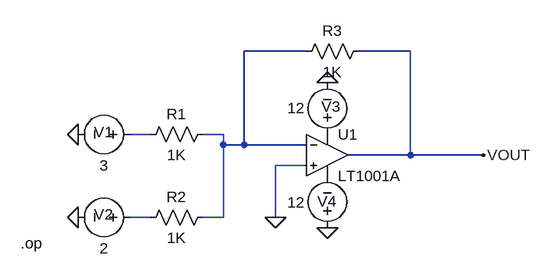
[diagram p0: schematic Summing Amplifier.asc]
Summing Amplifier.asc, the LTspice schematic file:
Version 4
SHEET 1 880 680
WIRE 208 -16 112 -16
WIRE 368 -16 288 -16
WIRE -32 112 -64 112
WIRE 80 112 48 112
WIRE 80 128 80 112
WIRE 112 128 112 -16
WIRE 112 128 80 128
WIRE 208 128 112 128
WIRE 368 144 368 -16
WIRE 368 144 272 144
WIRE 480 144 368 144
WIRE 208 160 160 160
WIRE -32 240 -64 240
WIRE 80 240 80 128
WIRE 80 240 48 240
WIRE 160 240 160 160
FLAG -144 112 0
FLAG -144 240 0
FLAG 160 240 0
FLAG 240 32 0
FLAG 240 256 0
FLAG 480 144 VOUT
SYMBOL OpAmps\\LT1001A 240 80 R0
SYMATTR InstName U1
SYMBOL voltage -48 112 R90
WINDOW 0 12 56 VBottom 2
WINDOW 3 32 56 VTop 2
WINDOW 123 0 0 Left 0
WINDOW 39 0 0 Left 0
SYMATTR InstName V1
SYMATTR Value 3
SYMBOL voltage -48 240 R90
WINDOW 0 11 56 VBottom 2
WINDOW 3 32 56 VTop 2
WINDOW 123 0 0 Left 0
WINDOW 39 0 0 Left 0
SYMATTR InstName V2
SYMATTR Value 2
SYMBOL res 64 96 R90
WINDOW 0 0 56 VBottom 2
WINDOW 3 32 56 VTop 2
SYMATTR InstName R1
SYMATTR Value 1K
SYMBOL res 64 224 R90
WINDOW 0 0 56 VBottom 2
WINDOW 3 32 56 VTop 2
SYMATTR InstName R2
SYMATTR Value 1K
SYMBOL res 304 -32 R90
WINDOW 0 0 56 VBottom 2
WINDOW 3 32 56 VTop 2
SYMATTR InstName R3
SYMATTR Value 1K
SYMBOL voltage 240 128 R180
WINDOW 0 -20 59 Left 2
WINDOW 3 34 57 Left 2
WINDOW 123 0 0 Left 0
WINDOW 39 0 0 Left 0
SYMATTR InstName V3
SYMATTR Value 12
SYMBOL voltage 240 272 R180
WINDOW 0 -14 57 Left 2
WINDOW 3 34 55 Left 2
WINDOW 123 0 0 Left 0
WINDOW 39 0 0 Left 0
SYMATTR InstName V4
SYMATTR Value 12
TEXT -232 280 Left 2 !.op

The netlist it stands for:
* Summing Amplifier.asc
XU1 0 N001 P001 P002 VOUT LT1001  ; LT1001A, pins In+ In- V+ V- OUT
V1 N002 0 3
V2 N003 0 2
R1 N001 N002 1K
R2 N001 N003 1K
R3 VOUT N001 1K
V3 P001 0 12
V4 0 P002 12
.op
.lib LTC.lib
.backanno
.end